# Altium schematic sheet P[10]WIFI_Bluetooth.SchDoc
size A3
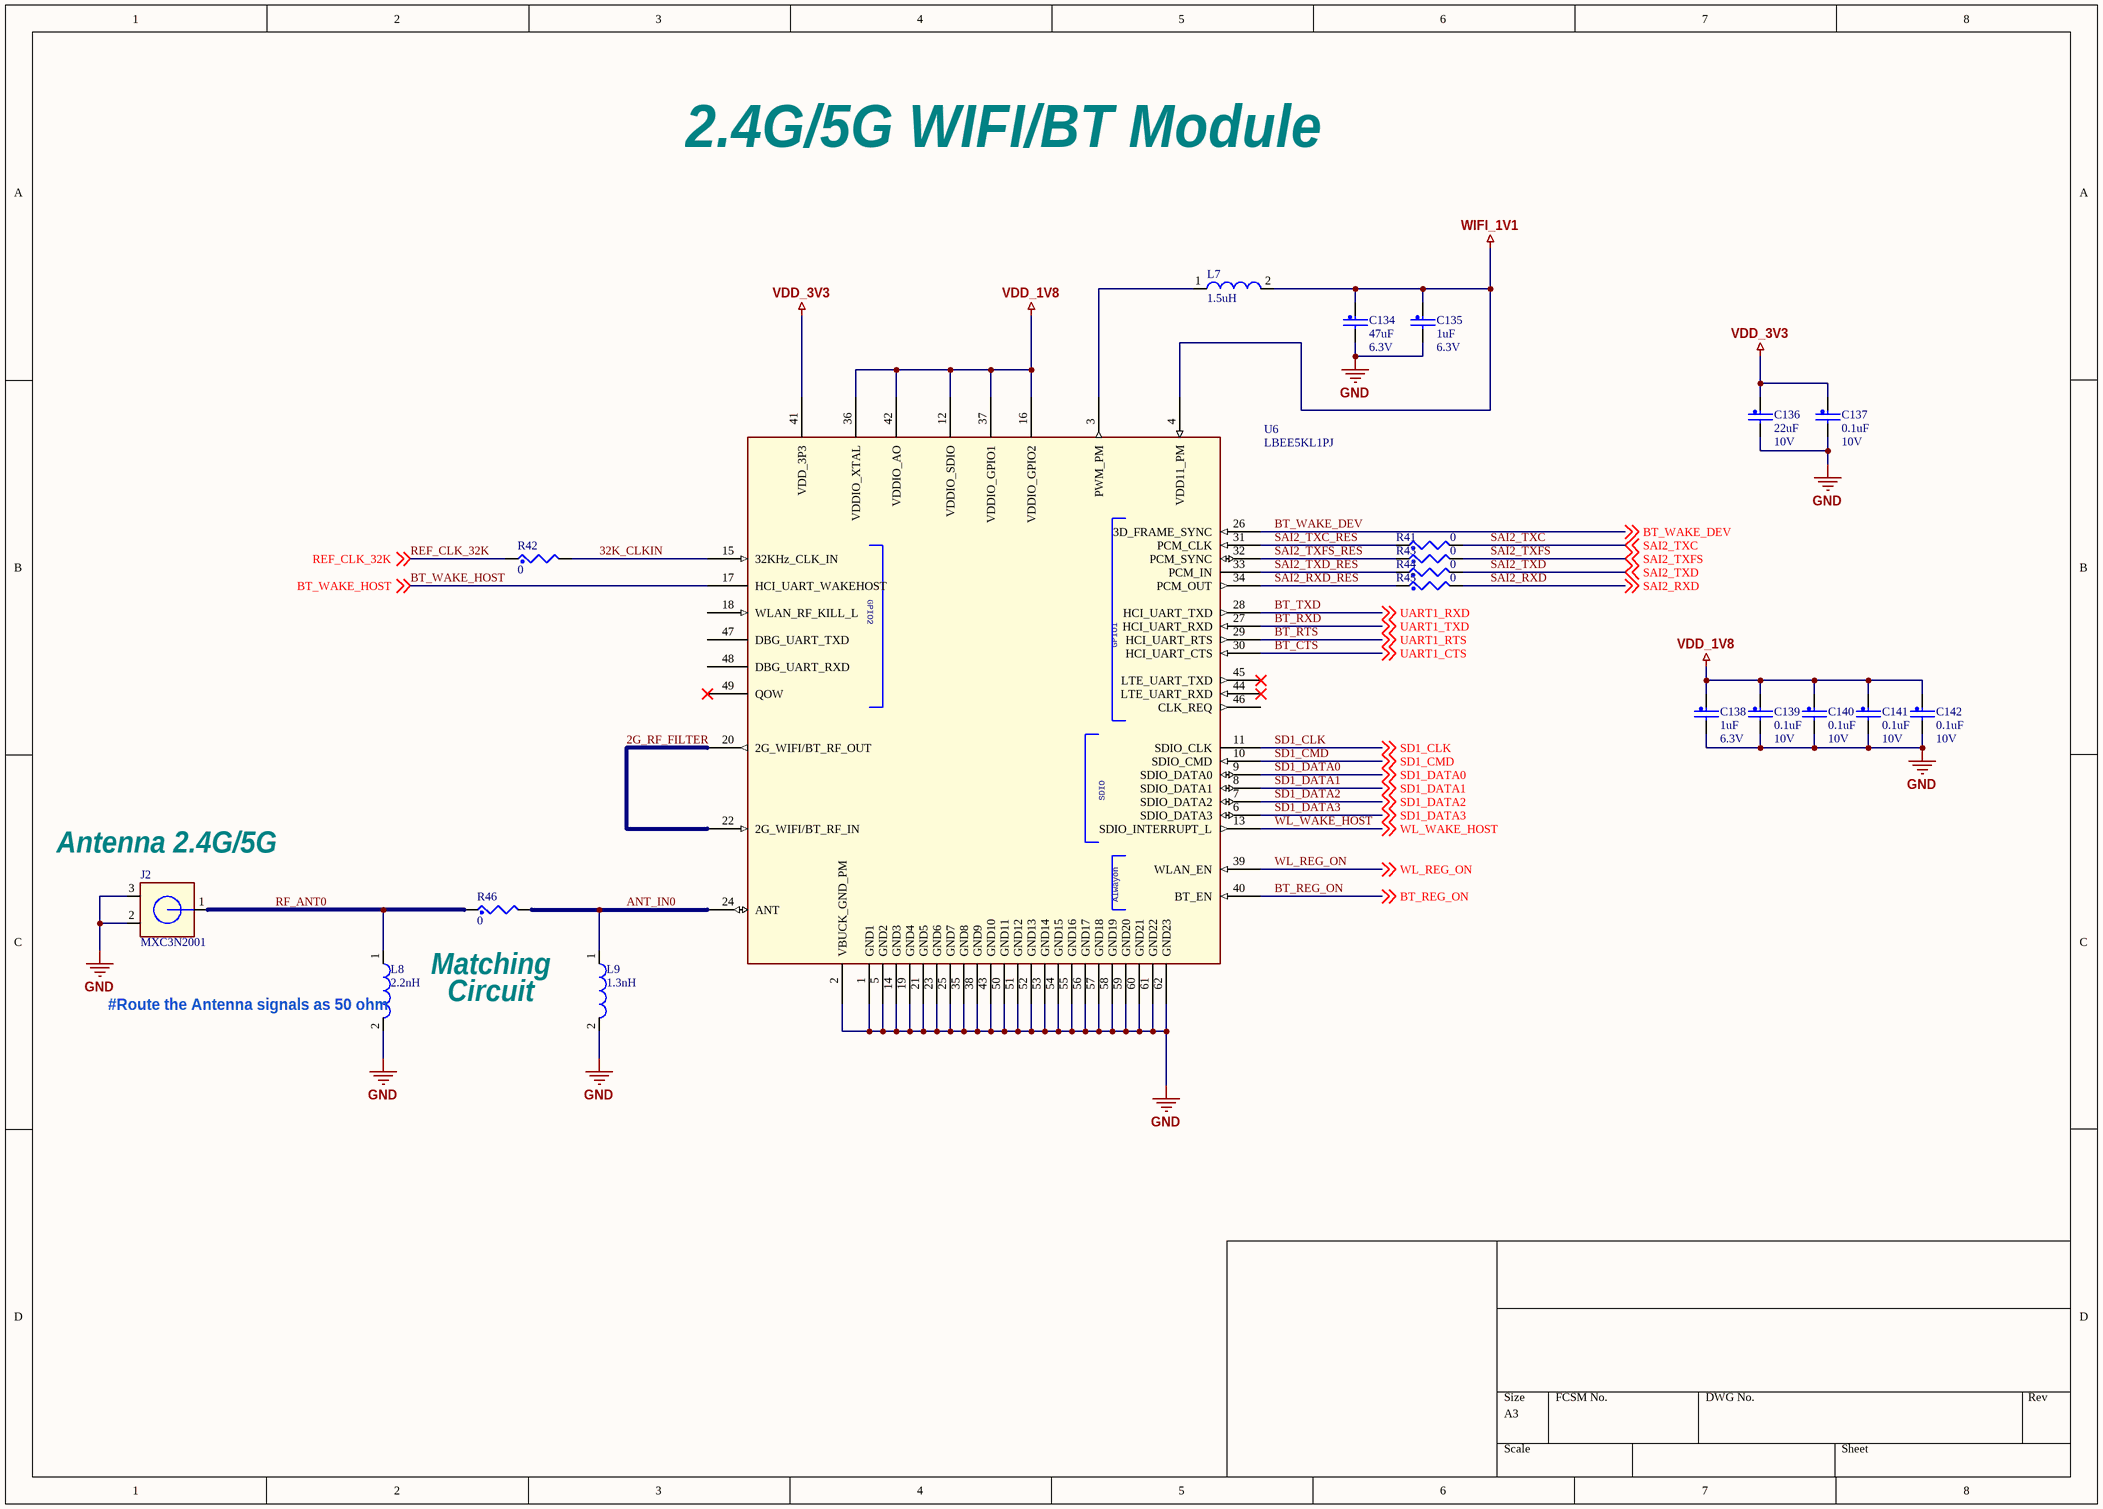
[diagram p0: P[10]WIFI_Bluetooth.SchDoc]

## Parts
C134  47uF  Voltage: 6.3V  [0805_CC]
C135  1uF  Voltage: 6.3V  [0201_CC - C]
C136  22uF  Voltage: 10V  [0603_CC]
C137  0.1uF  Voltage: 10V  [0201_CC - C]
C138  1uF  Voltage: 6.3V  [0201_CC - C]
C139  0.1uF  Voltage: 10V  [0201_CC - C]
C140  0.1uF  Voltage: 10V  [0201_CC - C]
C141  0.1uF  Voltage: 10V  [0201_CC - C]
C142  0.1uF  Voltage: 10V  [0201_CC - C]
J2  MXC3N2001  [CON_3_UFL_R_SMT]
L7  1.5uH  [INDC2016X100N]
L8  2.2nH  [0402_CC_IND]
L9  1.3nH  [0402_CC_IND]
R41  0  [0402_CC]
R42  0  [0402_CC]
R43  0  [0402_CC]
R44  0  [0402_CC]
R45  0  [0402_CC]
R46  0  [0402_CC]
U6  LBEE5KL1PJ  [LQFN62_0P6_7P6X7P4]

## Nets
GND: C134.2 C135.2 C136.2 C137.2 C138.2 C139.2 C140.2 C141.2 C142.2 J2.2(GND1) J2.3(GND2) L8.2 L9.2 U6.1(GND1) U6.2(VBUCK_GND_PM) U6.5(GND2) U6.14(GND3) U6.19(GND4) U6.21(GND5) U6.23(GND6) U6.25(GND7) U6.35(GND8) U6.38(GND9) U6.43(GND10) U6.50(GND11) U6.51(GND12) U6.52(GND13) U6.53(GND14) U6.54(GND15) U6.55(GND16) U6.56(GND17) U6.57(GND18) U6.58(GND19) U6.59(GND20) U6.60(GND21) U6.61(GND22) U6.62(GND23)
VDD_1V8: C138.1 C139.1 C140.1 C141.1 C142.1 U6.12(VDDIO_SDIO) U6.16(VDDIO_GPIO2) U6.36(VDDIO_XTAL) U6.37(VDDIO_GPIO1) U6.42(VDDIO_AO)
VDD_3V3: C136.1 C137.1 U6.41(VDD_3P3)
WIFI_1V1: C134.1 C135.1 L7.2 U6.4(VDD11_PM)
2G_RF_FILTER: U6.20(2G_WIFI/BT_RF_OUT) U6.22(2G_WIFI/BT_RF_IN)
32K_CLKIN: R42.2 U6.15(32KHz_CLK_IN)
ANT_IN0: L9.1 R46.2 U6.24(ANT)
BT_CTS: U6.30(HCI_UART_CTS) ; off-sheet UART1_CTS  [also labelled UART1_CTS]
BT_REG_ON: U6.40(BT_EN) ; off-sheet BT_REG_ON
BT_RTS: U6.29(HCI_UART_RTS) ; off-sheet UART1_RTS  [also labelled UART1_RTS]
BT_RXD: U6.27(HCI_UART_RXD) ; off-sheet UART1_TXD  [also labelled UART1_TXD]
BT_TXD: U6.28(HCI_UART_TXD) ; off-sheet UART1_RXD  [also labelled UART1_RXD]
BT_WAKE_DEV: U6.26(3D_FRAME_SYNC) ; off-sheet BT_WAKE_DEV
BT_WAKE_HOST: U6.17(HCI_UART_WAKEHOST) ; off-sheet BT_WAKE_HOST
REF_CLK_32K: R42.1 ; off-sheet REF_CLK_32K
RF_ANT0: J2.1(CTR) L8.1 R46.1
SAI2_RXD: R45.2 ; off-sheet SAI2_RXD
SAI2_RXD_RES: R45.1 U6.34(PCM_OUT)
SAI2_TXC: R41.2 ; off-sheet SAI2_TXC
SAI2_TXC_RES: R41.1 U6.31(PCM_CLK)
SAI2_TXD: R44.2 ; off-sheet SAI2_TXD
SAI2_TXD_RES: R44.1 U6.33(PCM_IN)
SAI2_TXFS: R43.2 ; off-sheet SAI2_TXFS
SAI2_TXFS_RES: R43.1 U6.32(PCM_SYNC)
SD1_CLK: U6.11(SDIO_CLK) ; off-sheet SD1_CLK
SD1_CMD: U6.10(SDIO_CMD) ; off-sheet SD1_CMD
SD1_DATA0: U6.9(SDIO_DATA0) ; off-sheet SD1_DATA0
SD1_DATA1: U6.8(SDIO_DATA1) ; off-sheet SD1_DATA1
SD1_DATA2: U6.7(SDIO_DATA2) ; off-sheet SD1_DATA2
SD1_DATA3: U6.6(SDIO_DATA3) ; off-sheet SD1_DATA3
WL_REG_ON: U6.39(WLAN_EN) ; off-sheet WL_REG_ON
WL_WAKE_HOST: U6.13(SDIO_INTERRUPT_L) ; off-sheet WL_WAKE_HOST
NetL7_1: L7.1 U6.3(PWM_PM)

Not connected (* = marked no-connect by the designer): U6 18(WLAN_RF_KILL_L) 44(LTE_UART_RXD)* 45(LTE_UART_TXD)* 46(CLK_REQ) 47(DBG_UART_TXD) 48(DBG_UART_RXD) 49(QOW)*

## Notes on the sheet
- 2.4G/5G WIFI/BT Module
- (near J2) Antenna 2.4G/5G
- Matching
- Circuit
- (near L8) #Route the Antenna signals as 50 ohm
- (in symbol LBEE5KL1PJ_QFN62) GPIO2; GPIO1; SDIO; Alwayon

## Library data of the parts
C134-C142 = CAP_NP: CLASS: DISCRETE
J2 = UFL: CON 1 COAX SKT SMT 55H AU\By Arman Arvand; CLASS: IO
L7-L9 = INDUCTOR: CLASS: DISCRETE
R41-R46 = RES: CLASS: DISCRETE
U6 = LBEE5KL1PJ_QFN62: LBEE5KL1PJ_QFN62\By Arman Arvand; CLASS: IC